# EAGLE design FT232H-basic (EAGLE 6.5.0)
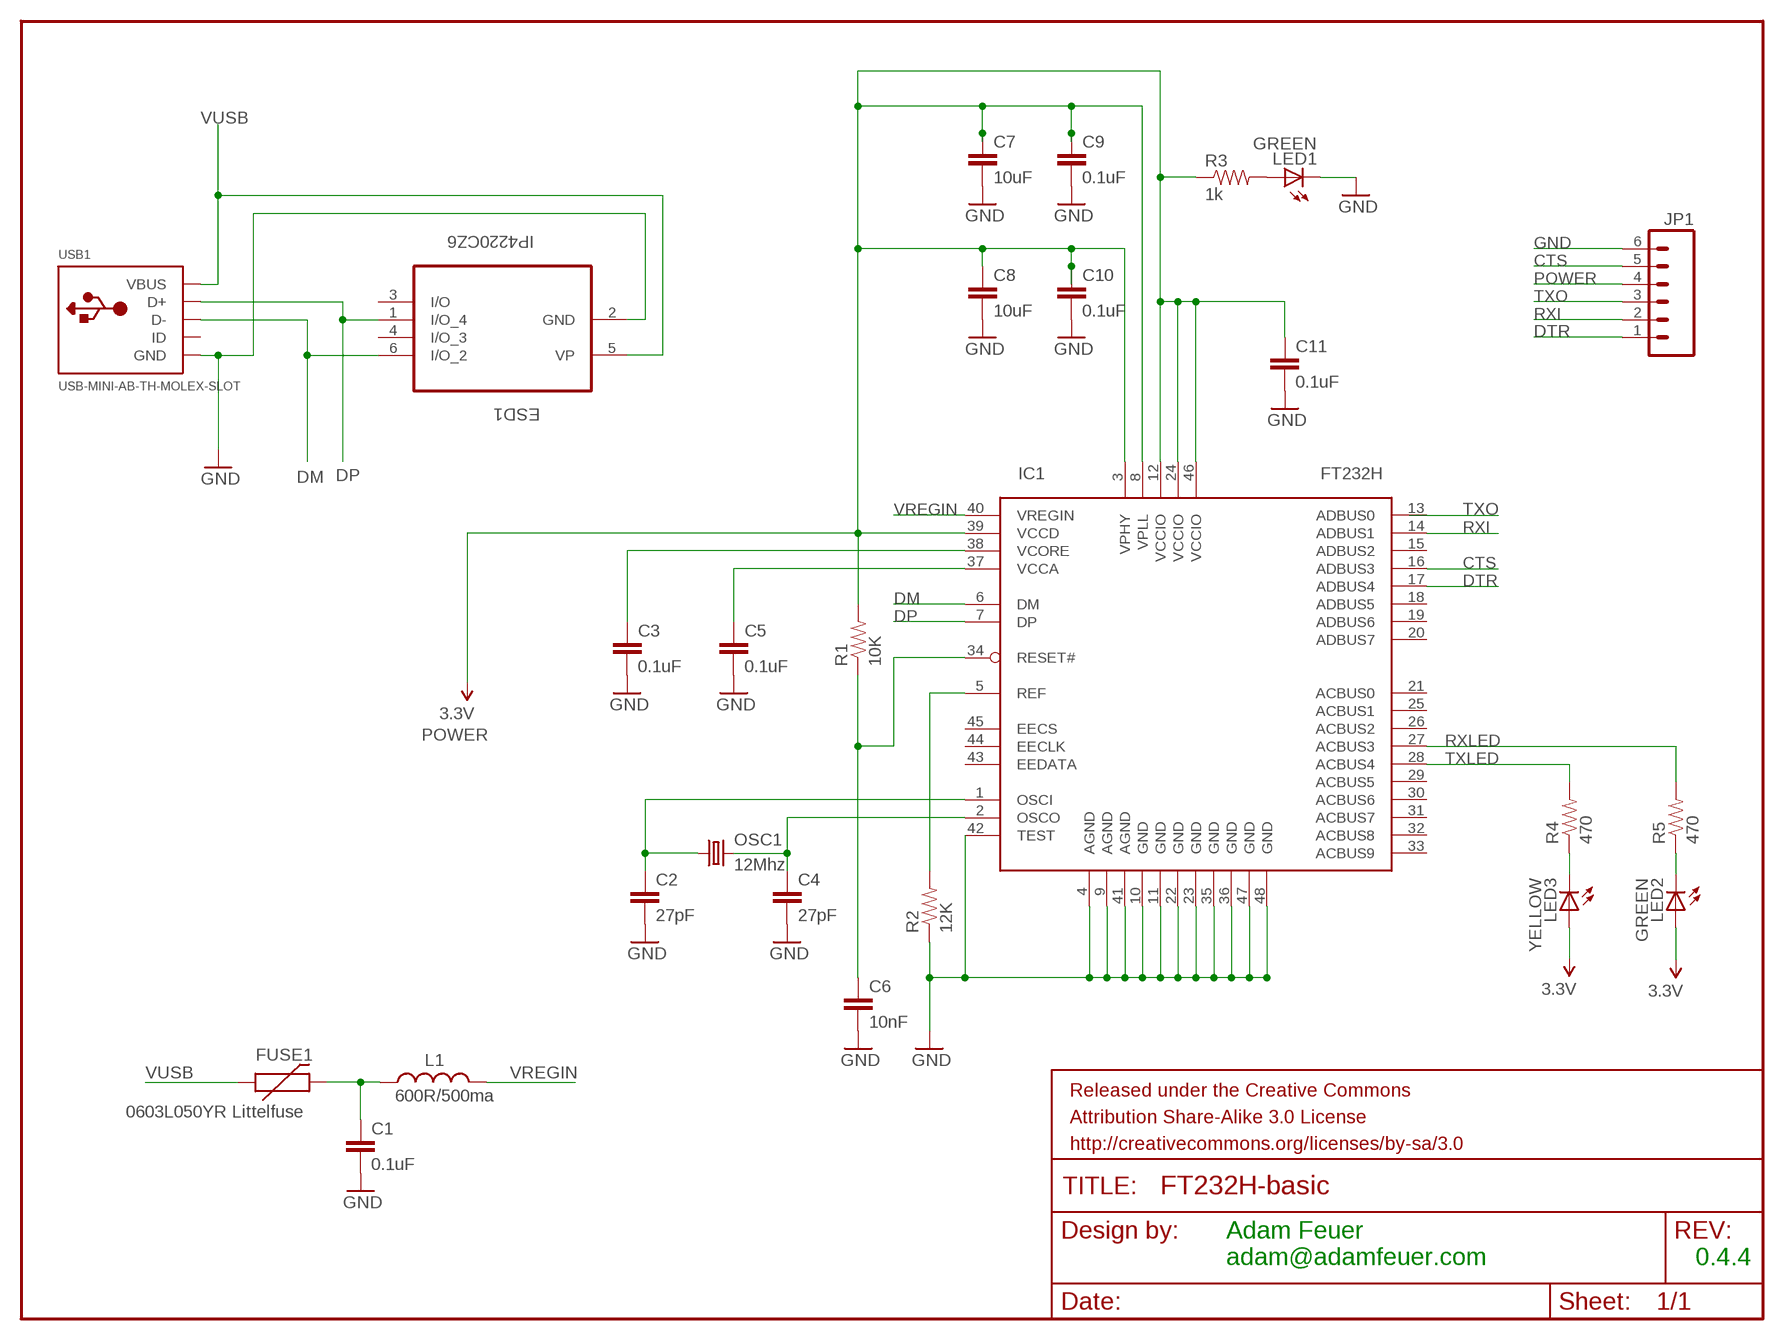
[diagram p0: schematic, sheet 1]

## Parts
C1  0.1uF  CAP0603-CAP  [0603-CAP]
C2  27pF  0.1UF-25V-5%(0603)  [0603-CAP]
C3  0.1uF  0.1UF-25V-5%(0603)  [0603-CAP]
C4  27pF  0.1UF-25V-5%(0603)  [0603-CAP]
C5  0.1uF  0.1UF-25V-5%(0603)  [0603-CAP]
C6  10nF  0.1UF-25V-5%(0603)  [0603-CAP]
C7  10uF  0.1UF-25V-5%(0603)  [0603-CAP]
C8  10uF  0.1UF-25V-5%(0603)  [0603-CAP]
C9  0.1uF  0.1UF-25V-5%(0603)  [0603-CAP]
C10  0.1uF  0.1UF-25V-5%(0603)  [0603-CAP]
C11  0.1uF  0.1UF-25V-5%(0603)  [0603-CAP]
ESD1  IP4220CZ6  [SOT95P275X110-6N]
FRAME1  FRAME-LETTER  [CREATIVE_COMMONS]
FUSE1  0603L050YR Littelfuse  PTC0603  [0603]
IC1  FT232H  [LQFP48]
JP1  M06SIP  [1X06]
L1  600R/500ma  INDUCTOR0603  [0603]
LED1  GREEN  LED-GREEN0603  [LED-0603]
LED2  GREEN  LED-GREEN0603  [LED-0603]
LED3  YELLOW  LED-YELLOW0603  [LED-0603]
OSC1  12Mhz  CRYSTAL5X3  [CRYSTAL-SMD-5X3]
R1  10K  10KOHM1/10W1%(0603)0603  [0603-RES]
R2  12K  RESISTOR0603  [0603-RES]
R3  1k  1K-1%  [0603-RES]
R4  470  1K-1%  [0603-RES]
R5  470  1K-1%  [0603-RES]
USB1  USB-MINI-AB-TH-MOLEX-SLOT  USB-MINIBTH-SLOT  [USB-MINI-AB-TH-MOLEX-SLOT]

## Nets
CTS: IC1.16(ADBUS3) JP1.5
DM: ESD1.6(I/O_2) IC1.6(DM) USB1.D-
DP: ESD1.1(I/O_4) IC1.7(DP) USB1.D+
DTR: IC1.17(ADBUS4) JP1.1
GND: C1.2 C2.2 C3.2 C4.2 C5.2 C6.2 C7.2 C8.2 C9.2 C10.2 C11.2 ESD1.2(GND) IC1.4(AGND) IC1.9(AGND) IC1.10(GND) IC1.11(GND) IC1.22(GND) IC1.23(GND) IC1.35(GND) IC1.36(GND) IC1.41(AGND) IC1.42(TEST) IC1.47(GND) IC1.48(GND) JP1.6 LED1.C R2.1 USB1.GND
N$1: C5.1 IC1.37(VCCA)
N$2: C3.1 IC1.38(VCORE)
N$3: C6.1 IC1.34(RESET#) R1.1
N$4: IC1.5(REF) R2.2
N$5: LED1.A R3.2
N$6: C1.1 FUSE1.2 L1.1
N$7: C4.1 IC1.2(OSCO) OSC1.3
N$8: LED3.C R4.1
N$10: LED2.C R5.1
OSC1: C2.1 IC1.1(OSCI) OSC1.1
POWER: C7.1 C8.1 C9.1 C10.1 C11.1 IC1.3(VPHY) IC1.8(VPLL) IC1.12(VCCIO) IC1.24(VCCIO) IC1.39(VCCD) IC1.46(VCCIO) JP1.4 LED2.A LED3.A R1.2 R3.1 ; supply symbol labelled 3.3V
RXI: IC1.14(ADBUS1) JP1.2
RXLED: IC1.27(ACBUS3) R5.2
TXLED: IC1.28(ACBUS4) R4.2
TXO: IC1.13(ADBUS0) JP1.3
VREGIN: IC1.40(VREGIN) L1.2
VUSB: ESD1.5(VP) FUSE1.1 USB1.VBUS
Unconnected: ESD1.3(I/O) ESD1.4(I/O_3) IC1.15(ADBUS2) IC1.18(ADBUS5) IC1.19(ADBUS6) IC1.20(ADBUS7) IC1.21(ACBUS0) IC1.25(ACBUS1) IC1.26(ACBUS2) IC1.29(ACBUS5) IC1.30(ACBUS6) IC1.31(ACBUS7) IC1.32(ACBUS8) IC1.33(ACBUS9) IC1.43(EEDATA) IC1.44(EECLK) IC1.45(EECS) USB1.ID

## Notes on the sheet
- Adam Feuer
  adam@adamfeuer.com
- 0.4.4

## Library data of the parts
C1 = SparkFun-Passives:CAP: Capacitor Standard 0603 ceramic capacitor, and 0.1" leaded capacitor.
C2 C4 C6-C8 = SparkFun-Capacitors:0.1UF-25V-5%(0603): CAP-08604; PROD_ID: CAP-08604; VALUE: 0.1uF
C3 C5 C9-C11 = SparkFun-Capacitors:0.1UF-25V-5%(0603): CAP-08604; PROD_ID: CAP-08604
ESD1 = NXP_By_element14_Batch_1:IP4220CZ6: Dual Schmitt-Trigger Inverter; MPN: IP4220CZ6; OC_FARNELL: 1506629; OC_NEWARK: 61M6815; PACKAGE: SSOT-6; SUPPLIER: NXP
FRAME1 = SparkFun-Aesthetics:FRAME-LETTER: Schematic Frame Standard 8.5x11 US Letter frame
FUSE1 = SparkFun-PowerIC:PTC: Resettable Fuse PTC Resettable Fuse. Spark Fun Electronics SKU : COM-08357
IC1 = ft232h:FT232H: FTDI FT232H DS: http://www.ftdichip.com/Support/Documents/DataSheets/ICs/DS_FT232H.pdf
JP1 = SparkFun-Connectors:M06: Header 6 Standard 6-pin 0.1" header. Use with straight break away headers (SKU : PRT-00116), right angle break away headers (PRT-00553), swiss pins (PRT-00743), machine pins (PRT-00117), and female headers (PRT-00115). Molex polarized connector foot print use with SKU : PRT-08094 with associated crimp pins and housings. NOTES ON THE VARIANTS LOCK and LOCK_LONGPADS... This footprint was designed to help hold the alignment of a through-hole component (i.e. 6-pin header) while soldering it into place. You may notice that each hole has been shifted either up or down by 0.005 of an inch from it's more standard position (which is a perfectly straight line). This slight alteration caused the pins (the squares in the middle) to touch the edges of the holes. Because they are alternating, it causes a "brace" to hold the component in place. 0.005 has proven to be the perfect amount of "off-center" position when using our standard breakaway headers. Although looks a little odd when you look at the bare footprint, once you have a header in there, the alteration is very hard to notice. Also,if you push a header all the way into place, it is covered up entirely on the bottom side. This idea of altering the position of holes to aid alignment will be further integrated into the Sparkfun Library for other footprints. It can help hold any component with 3 or more connection pins.
L1 = SparkFun-Passives:INDUCTOR: Inductors Basic Inductor/Choke - 0603 and 1206. Footprints are not proven and vary greatly between part numbers. SRN6045- 33uH, 20% 1.4A
LED1 LED2 = SparkFun-LED:LED-GREEN: Various green LEDs 0603- DIO-00821 LARGE- DIO-00862 LILYPAD- DIO-09910; PROD_ID: DIO-00821
LED3 = SparkFun-LED:LED-YELLOW: Yellow SMD LEDs LilyPad 1206- DIO-09909 0603- DIO-09003; PROD_ID: DIO-09003
OSC1 = SparkFun-FreqCtrl:CRYSTAL: Various standard crystals. Proven footprints. Spark Fun Electronics SKU : COM-00534
R1 = SparkFun-Resistors:10KOHM1/10W1%(0603): RES-00824; PROD_ID: RES-00824
R2 = SparkFun-Resistors:RESISTOR: Resistor Basic schematic elements and footprints for 0603, 1206, and PTH resistors.
R3 = SparkFun-Resistors:1K-1%: 1k-ohm SMT 1/10W - 1% (0603) RES-07856; PROD_ID: RES-07856
R4 R5 = SparkFun-Resistors:1K-1%: 1k-ohm SMT 1/10W - 1% (0603) RES-07856; PROD_ID: RES-07856; VALUE: 1k
USB1 = USB-Mini-Molex:USB-MINIB: USB Connectors USBMINIB Thru-hole Mini-AB Molex RA TH-SLOT is Molex part # 56579-0576 (gbulmer) - Untested Thru-hole Mini-AB Molex RA TH-DRILL is Molex part # 56579-0576 **CHECK WITH PCB Maker close-drilling of holes is okay (gbulmer) - Untested Thru-hole Mini-B RA MULTICOMP-TH is a Multicomp MC32599 from Farnell.com (gbulmer) - Untested

## Net classes
1 GND: width 0.61 mm, clearance 0.305 mm
2 VREGIN: width 0.61 mm, clearance 0.305 mm

## Board
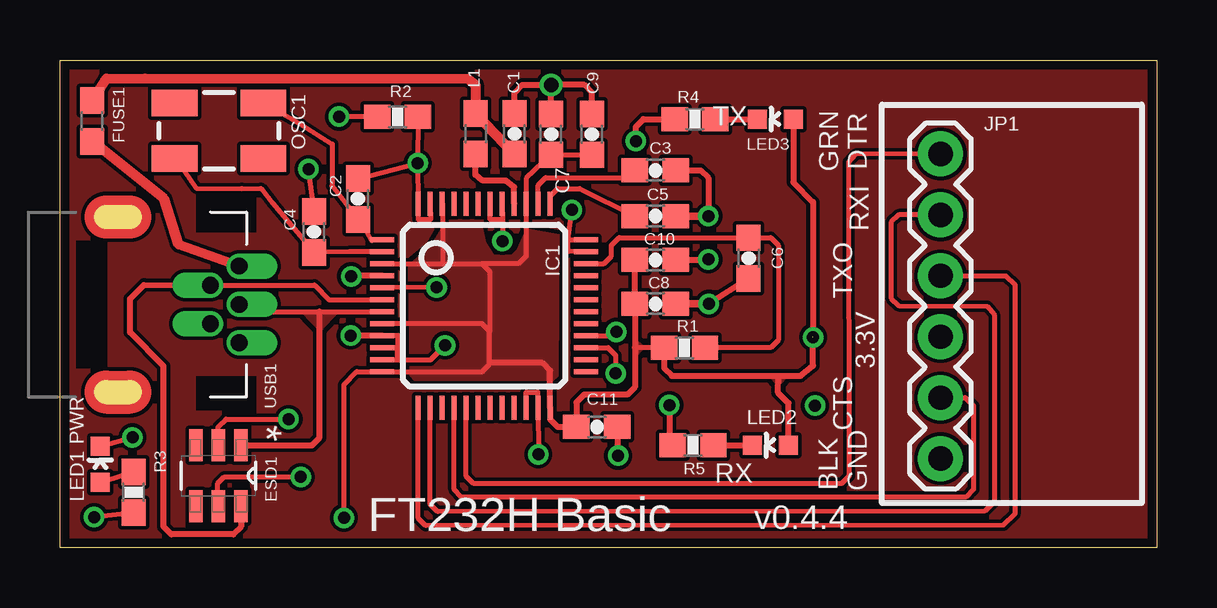
[diagram p1: board, top side]
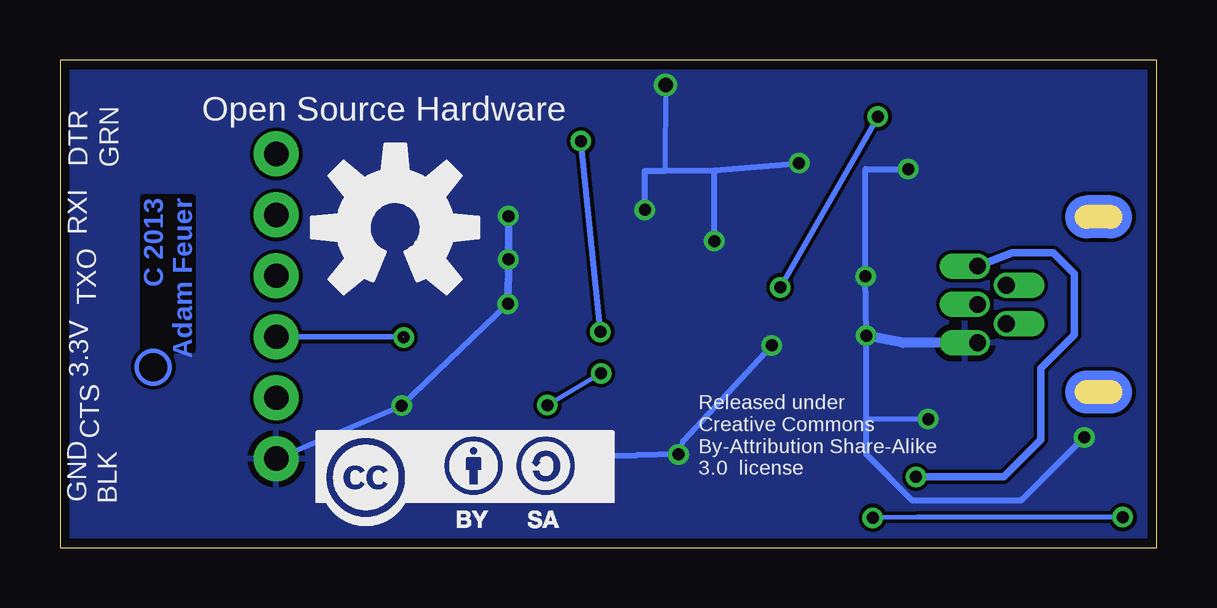
[diagram p2: board, bottom side, seen from below]

Size 45.72 x 20.32 mm. Coordinates in mm from the lower left corner, seen from the top.
Outline: 0,0 0,20.32 45.72,20.32 45.72,0 0,0
Copper layers (1*16): Top 0.0356mm / dielectric 1.5011mm / Bottom 0.0356mm
Design rules "LaenPCBOrder *": minimum track width 6mil, minimum drill 13mil, track to track 6mil, track to pad 6mil, pad to pad 6mil, via to via 6mil, smd to smd 6mil, copper to edge 15mil, drill to drill 6mil, minimum pad ring 7mil, minimum via ring 7mil, stop-mask expansion 4mil, vias tented up to drill 0.50291875mm, thermal gap 10mil

### Footprints (pad centres in the part's own frame; a part is rotated, then mirrored left to right if it is on the bottom)
0603-CAP = smd 1.1 x 1: 1 -0.85,0; 2 0.85,0
SOT95P275X110-6N = smd 1.321 x 0.559: 1 -1.27,0.94; 2 -1.27,0; 3 -1.27,-0.94; 4 1.27,-0.94; 5 1.27,0; 6 1.27,0.94
0603 = smd 1.1 x 1: 1 -0.85,0; 2 0.85,0
LQFP48 = smd 0.2 x 1: 1 -2.75,-4.25; 2 -2.25,-4.25; 3 -1.75,-4.25; 4 -1.25,-4.25; 5 -0.75,-4.25; 6 -0.25,-4.25; 7 0.25,-4.25; 8 0.75,-4.25; 9 1.25,-4.25; 10 1.75,-4.25; 11 2.25,-4.25; 12 2.75,-4.25; 25 2.75,4.25; 26 2.25,4.25; 27 1.75,4.25; 28 1.25,4.25; 29 0.75,4.25; 30 0.25,4.25; 31 -0.25,4.25; 32 -0.75,4.25; 33 -1.25,4.25; 34 -1.75,4.25; 35 -2.25,4.25; 36 -2.75,4.25 | smd 1 x 0.2: 13 4.25,-2.75; 14 4.25,-2.25; 15 4.25,-1.75; 16 4.25,-1.25; 17 4.25,-0.75; 18 4.25,-0.25; 19 4.25,0.25; 20 4.25,0.75; 21 4.25,1.25; 22 4.25,1.75; 23 4.25,2.25; 24 4.25,2.75; 37 -4.25,2.75; 38 -4.25,2.25; 39 -4.25,1.75; 40 -4.25,1.25; 41 -4.25,0.75; 42 -4.25,0.25; 43 -4.25,-0.25; 44 -4.25,-0.75; 45 -4.25,-1.25; 46 -4.25,-1.75; 47 -4.25,-2.25; 48 -4.25,-2.75
1X06 = drill 1.016 pad 1.88: 1 0,0; 2 2.54,0; 3 5.08,0; 4 7.62,0; 5 10.16,0; 6 12.7,0
LED-0603 = smd 0.8 x 0.8: A 0,-0.75; C 0,0.75
CRYSTAL-SMD-5X3 = smd 1.9 x 1.1: 1 -1.85,-1.15; 2 1.85,-1.15; 3 1.85,1.15; 4 -1.85,1.15
0603-RES = smd 1.1 x 1: 1 -0.85,0; 2 0.85,0
USB-MINI-AB-TH-MOLEX-SLOT = drill 0.7 offset: D+ 1.2,0; D- 0,0.8; GND 1.2,-1.6; ID 0,-0.8; VBUS 1.2,1.6

### Placement (x,y rotation side)
C1  18.95,17.25 90 top
C2  12.42,14.53 90 top
C3  24.82,15.72 0 top
C4  10.59,13.16 90 top
C5  24.82,13.82 0 top
C6  28.7,12.06 270 top
C7  20.47,17.22 90 top
C8  24.82,10.16 0 top
C9  22.17,17.22 90 top
C10  24.82,11.99 0 top
C11  22.38,5.03 0 top
CC-BY-SA-LOGO  [CC-BY-SA]  35.18,0.56 0 bottom
ESD1  6.6,3 270 top
FRAME1  20.32,-13.97 0 top  (outside the outline)
FUSE1  1.35,17.78 90 top
IC1  17.68,10.08 270 top
JP1  36.7,16.41 270 top
L1  17.32,17.25 270 top
LED1  1.68,3.48 0 top
LED2  29.62,4.27 90 top
LED3  29.82,17.86 90 top
OSC1  6.63,17.37 180 top
R1  26.03,8.33 180 top
R2  14.07,17.96 180 top
R3  3.07,2.31 90 top
R4  26.47,17.86 180 top
R5  26.39,4.27 180 top
U$1  [OSHW-LOGO-L]  31.75,13.33 0 bottom
USB1  6.27,10.13 0 top

### Tracks (layer width: path | path; a pad name or v marks a point on that pad's centre or on a via)
CTS
  Top 0.203: JP1.5 37.73,6.25 38.07,5.91 38.07,2.43 37.76,2.11 16.75,2.11 16.43,2.43 IC1.16
DM
  Top 0.203: USB1.D- 10.6,10.93 11.21,10.33 IC1.6
  Top 0.254: ESD1.6 7.54,0.88 7.23,0.56 4.64,0.56 4.32,0.88 4.32,7.57 2.92,8.97 2.92,10.36 3.51,10.95 USB1.D-
DP
  Top 0.203: USB1.D+ 7.78,9.83 10.82,9.83 IC1.7
  Top 0.254: ESD1.1 10.5,4.27 10.82,4.58 10.82,9.83
  pour Top: 10.06,9.83 10.85,8.99 11.63,9.86 10.03,9.83
DTR
  Top 0.203: JP1.1 33.16,16.38 32.87,16.07 32.89,2.98 32.57,2.67 17.25,2.67 16.93,2.98 IC1.17
GND  (via drill 0.5, 0.6)
  Top 0.203: IC1.42 17.93,13.67 18.44,13.67 | IC1.11 14.07,7.82 | 14.07,7.82 14.07,8.33 IC1.10 14.1,8.33 14.1,8.84 IC1.9 | IC1.35 21.18,12.34 21.18,12.83 | 21.18,12.83 IC1.36 | IC1.22 19.43,6.48 19.91,6.48 IC1.23 v19.94,3.89 | IC1.41 18.44,13.67 | IC1.47 15.44,13.67 14.93,13.67 IC1.48 v14.91,16.03 | LED1.C v3.02,4.6 | 18.44,13.67 v18.44,12.78 | 21.18,12.83 v21.34,14.07 | 14.07,7.82 15.44,7.82 v16.05,8.43 | R2.1 v14.91,16.03 | C4.2 10.59,14.06 v10.36,15.77 | C2.2 v14.91,16.03 | ESD1.2 6.6,5.04 6.92,5.36 v9.53,5.36
  Top 0.254: C7.2 v20.47,19.28 | C11.2 v23.27,3.83 | C6.2 v27.05,10.16 | IC1.4 12.14,11.33 v12.14,11.3 | IC1.9 v12.12,8.84 | C1.2 18.95,18.96 19.27,19.28 v20.47,19.28 | C9.2 22.17,18.96 21.86,19.28 v20.47,19.28 | C3.2 26.71,15.72 27.03,15.4 v27.03,13.82 | C10.2 27,11.99 v27.03,12.01
  Top 0.305: C5.2 v27.03,13.82 | C8.2 v27.05,10.16
  Bottom 0.203: JP1.6 v31.47,5.92 | v20.47,19.28 20.5,15.7 | v16.05,8.43 16.05,8.41 | v19.94,3.89 19.73,4.44 | v9.53,5.36 12.12,5.36
  Bottom 0.254: 18.44,15.72 20.5,15.7 21.34,15.7 v21.34,14.07 | 18.44,15.72 v14.91,16.03 | v10.36,15.77 12.14,15.77 v12.14,11.3 v12.12,8.84 12.12,5.36 12.12,3.89 10.19,1.96 5.66,1.96 v3.02,4.6 | v18.44,12.78 18.44,15.72 | 16.05,8.41 19.73,4.44 | v19.94,3.89 21.67,3.86 v23.27,3.83 | v31.47,5.92 v27.05,10.16
  Bottom 0.305: v27.03,13.82 v27.03,12.01 v27.05,10.16
  Bottom 0.406: USB1.GND 10.59,8.54 v12.12,8.84
  pour Bottom: 0,20.32 -0.05,-0.05 45.72,0 45.72,20.32
N$1
  Top 0.203: IC1.37 20.43,14.64 20.75,14.96 21.67,14.96 C5.1
N$2
  Top 0.203: IC1.38 19.93,15.1 20.25,15.42 23.66,15.42 C3.1
N$3
  Top 0.203: IC1.34 22.67,11.83 22.99,12.15 22.99,12.6 23.3,12.92 C6.1 29.63,12.92 29.95,12.6 29.95,8.65 29.63,8.33 R1.1
N$4  (via drill 0.5)
  Top 0.203: R2.2 v11.63,17.96 | v15.7,10.85 IC1.5
  Bottom 0.254: v11.63,17.96 v15.7,10.85
N$5
  Top 0.203: LED1.A R3.2
N$6
  Top 0.406: C1.1 L1.1 17.32,19.29 17.01,19.53 3.54,19.56 1.93,19.55 FUSE1.2
N$7
  Top 0.203: IC1.2 12.09,12.33 C4.1 9.54,13.55 8.87,14.35 8.38,14.97 7.58,14.96 5.68,14.99 4.96,16.04 OSC1.3
N$8
  Top 0.254: R4.1 LED3.C
N$9
  pour Top (rank 6): 0,0 45.72,0 45.8,20.27 0,20.32
N$10
  Top 0.254: R5.1 LED2.C
OSC1
  Top 0.203: OSC1.1 8.83,18.35 10.03,17.65 11.35,16.82 11.34,15.08 C2.1 12.62,13.48 12.99,12.81 IC1.1
POWER  (via drill 0.5)  (1 unrouted)
  Top 0.203: 17.91,9.02 17.91,7.7 17.91,7.65 17.59,7.33 IC1.12 12.37,7.34 11.84,6.78 v11.84,1.24 | 17.91,9.02 17.59,9.33 IC1.8 | IC1.3 15.95,11.83 | 15.95,11.83 17.59,11.83 | 17.59,11.83 17.91,11.52 17.91,9.02 | IC1.46 15.95,14.31 15.95,11.83 | 17.59,11.83 19.11,11.83 19.43,12.15 IC1.39 19.43,15.39 C7.1 C9.1 | R3.1 v1.42,1.27 | R1.2 23.97,8.33
  Top 0.254: C10.1 C8.1 23.97,8.33 23.97,6.69 23.65,6.38 21.84,6.38 21.53,6.06 C11.1 20.75,5.03 20.43,5.35 IC1.24 20.43,7.38 20.11,7.7 17.91,7.7 | R1.2 25.19,7.48 25.5,7.16 29.95,7.16 | 29.95,7.16 30.87,7.16 31.39,7.58 v31.39,8.76 | 29.95,7.16 29.93,6.45 30.37,6.02 LED2.A | LED3.A 30.57,15.23 31.39,14.4 31.39,8.79
  Bottom 0.203: v1.42,1.27 9.98,1.27 v11.84,1.24
  Bottom 0.254: v31.39,8.76 JP1.4
  pour Top: 23.95,8.74 24.38,8.38 24.38,8.33 23.95,7.87
  pour Top: 14.53,10.13 14.58,7.19 14.76,6.98 20.55,6.96 20.78,7.16 20.83,13.03 19.43,13.28 19.02,12.4 18.82,12.19 18.08,12.19 17.75,12.7 17.63,13.31 15.88,13.28 15.44,12.55 14.5,11.76
  pour Top: 29.46,7.21 29.95,6.71 30.4,7.19
RXI
  Top 0.203: JP1.2 34.96,13.87 34.65,13.55 34.65,10.4 34.96,10.08 38.65,10.06 38.94,9.71 38.94,1.92 38.55,1.52 15.75,1.5 15.43,1.82 IC1.14
RXLED  (via drill 0.5)
  Top 0.203: IC1.27 22.85,8.33 23.16,8.02 v23.16,7.26
  Top 0.254: v25.4,5.94 25.4,4.41 R5.2
  Bottom 0.203: v23.16,7.26 v25.4,5.94
TXLED  (via drill 0.5)
  Top 0.203: IC1.28 23.03,8.83 v23.19,8.99
  Top 0.254: v24,16.94 24,17.54 24.32,17.86 R4.2
  Bottom 0.254: v23.19,8.99 v24,16.94
TXO
  Top 0.203: JP1.3 39.43,11.33 39.8,10.99 39.8,1.38 39.33,0.94 15.25,0.91 14.93,1.23 IC1.13
VREGIN
  Top 0.254: IC1.40 18.93,15.02 18.59,15.29 17.62,15.29 17.32,15.53 L1.2
VUSB  (via drill 0.5)
  Top 0.203: 6.58,1.75 6.58,2.68 6.85,2.95 v10.03,2.95
  Top 0.254: ESD1.5 6.58,1.75
  Top 0.406: USB1.VBUS 4.95,12.62 4.34,14.53 FUSE1.1
  Bottom 0.305: USB1.VBUS 6.02,12.29 4.3,12.29 3.43,11.42 3.43,8.87 4.83,7.47 4.83,4.5 6.38,2.95 v10.03,2.95
(copper drawn outside any net)
  shapes: Bottom circle x1

### Text on the board
Bottom: C 2013 / Adam Feuer
tPlace: TX | PWR | RX | v0.4.4
bPlace: Open Source Hardware | Released under / Creative Commons / By-Attribution Share-Alike / 3.0 license
tNames: DTR | GRN | RXI | TXO | 3.3V | CTS | BLK | GND | FT232H Basic
bNames: GRN | DTR | RXI | TXO | 3.3V | CTS | BLK | GND